# EAGLE design Standalone Control Board (EAGLE 7.1.0)
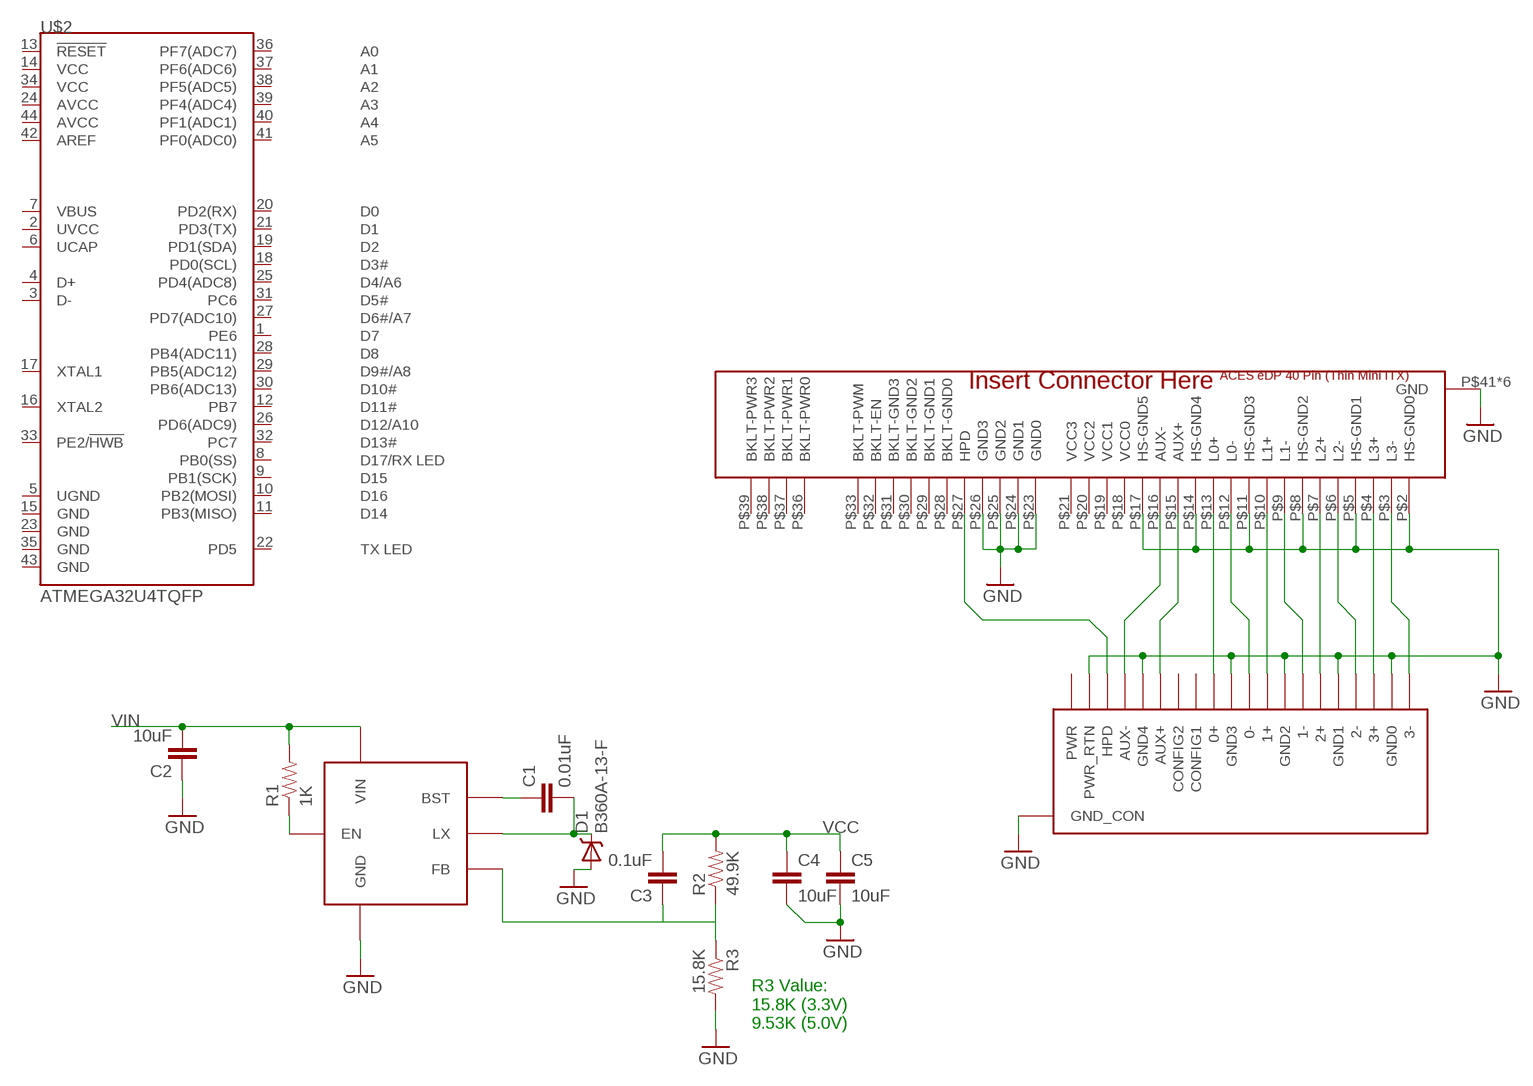
[diagram p0: schematic, sheet 1]

## Parts
C1  0.01uF  CAP0805  [0805]
C2  10uF  CAP0805  [0805]
C3  0.1uF  CAP0805  [0805]
C4  10uF  CAP0805  [0805]
C5  10uF  CAP0805  [0805]
D1  B360A-13-F  DIODE-SCHOTTKY_  [SMA-DIODE]
F1  EDP-40PIN-ACES  [ACES-50203-040]
R1  1K  RESISTOR0805-RES  [0805]
R2  49.9K  RESISTOR0805-RES  [0805]
R3  15.8K  RESISTOR0805-RES  [0805]
U$1  DP-SINK  [MOLEX-47272-0001]
U$2  ATMEGA32U4TQFP  [SPARKFUN-DIGITALIC_TQFP44]
U$3  AOZ1281-BUCK  [2X2-DFN]

## Nets
0_N: F1.P$12(L0-) U$1.P$14(0-)
0_P: F1.P$13(L0+) U$1.P$16(0+)
1_N: F1.P$9(L1-) U$1.P$11(1-)
1_P: F1.P$10(L1+) U$1.P$13(1+)
2_N: F1.P$6(L2-) U$1.P$8(2-)
2_P: F1.P$7(L2+) U$1.P$10(2+)
3_N: F1.P$3(L3-) U$1.P$5(3-)
3_P: F1.P$4(L3+) U$1.P$7(3+)
AUX_N: F1.P$16(AUX-) U$1.P$21(AUX-)
AUX_P: F1.P$15(AUX+) U$1.P$19(AUX+)
GND: C2.1 C4.2 C5.2 D1.A F1.P$2(HS-GND0) F1.P$5(HS-GND1) F1.P$8(HS-GND2) F1.P$11(HS-GND3) F1.P$14(HS-GND4) F1.P$17(HS-GND5) F1.P$23(GND0) F1.P$24(GND1) F1.P$25(GND2) F1.P$26(GND3) F1.P$41(GND) F1.P$42(GND) F1.P$43(GND) F1.P$44(GND) F1.P$45(GND) F1.P$46(GND) R3.2 U$1.GND1(GND_CON) U$1.GND2(GND_CON) U$1.GND3(GND_CON) U$1.GND4(GND_CON) U$1.P$6(GND0) U$1.P$9(GND1) U$1.P$12(GND2) U$1.P$15(GND3) U$1.P$20(GND4) U$1.P$23(PWR_RTN) U$3.6(GND) U$3.7(GND) U$3.CENTER(GND)
N$1: R1.1 U$3.4(EN)
N$2: C3.1 U$3.5(FB)
N$3: C1.1 U$3.8(BST)
N$4: C1.2 D1.C U$3.1(LX)
N$5: R2.1 R3.1
N$14: F1.P$27(HPD) U$1.P$22(HPD)
VCC: C3.2 C4.1 C5.1 R2.2
VIN: C2.2 R1.2 U$3.2(VIN) U$3.3(VIN)
Unconnected: F1.P$32(BKLT-EN) F1.P$33(BKLT-PWM) U$1.P$17(CONFIG1) U$1.P$18(CONFIG2) U$2.1(PE6) U$2.2(UVCC) U$2.3(D-) U$2.4(D+) U$2.5(UGND) U$2.6(UCAP) U$2.7(VBUS) U$2.8(PB0(SS)) U$2.9(PB1(SCK)) U$2.10(PB2(MOSI)) U$2.11(PB3(MISO)) U$2.12(PB7) U$2.13(!RESET) U$2.14(VCC) U$2.15(GND) U$2.16(XTAL2) U$2.17(XTAL1) U$2.18(PD0(SCL)) U$2.19(PD1(SDA)) U$2.20(PD2(RX)) U$2.21(PD3(TX)) U$2.22(PD5) U$2.23(GND) U$2.24(AVCC) U$2.25(PD4(ADC8)) U$2.26(PD6(ADC9)) U$2.27(PD7(ADC10)) U$2.28(PB4(ADC11)) U$2.29(PB5(ADC12)) U$2.30(PB6(ADC13)) U$2.31(PC6) U$2.32(PC7) U$2.33(PE2/!HWB) U$2.34(VCC) U$2.35(GND) U$2.36(PF7(ADC7)) U$2.37(PF6(ADC6)) U$2.38(PF5(ADC5)) U$2.39(PF4(ADC4)) U$2.40(PF1(ADC1)) U$2.41(PF0(ADC0)) U$2.42(AREF) U$2.43(GND) U$2.44(AVCC)

## Notes on the sheet
- R3 Value:
  15.8K (3.3V)
  9.53K (5.0V)

## Power pins joined to a net without a drawn wire
BKLT-GND0: F1.P$28(BKLT-GND0)
BKLT-GND1: F1.P$29(BKLT-GND1)
BKLT-GND2: F1.P$30(BKLT-GND2)
BKLT-GND3: F1.P$31(BKLT-GND3)
BKLT-PWR0: F1.P$36(BKLT-PWR0)
BKLT-PWR1: F1.P$37(BKLT-PWR1)
BKLT-PWR2: F1.P$38(BKLT-PWR2)
BKLT-PWR3: F1.P$39(BKLT-PWR3)
PWR: U$1.P$24(PWR)
VCC0: F1.P$18(VCC0)
VCC1: F1.P$19(VCC1)
VCC2: F1.P$20(VCC2)
VCC3: F1.P$21(VCC3)

## Library data of the parts
C1-C5 = SparkFun-Passives:CAP: Capacitor Standard 0603 ceramic capacitor, and 0.1" leaded capacitor.
D1 = SparkFun-DiscreteSemi:DIODE-SCHOTTKY: Commonly MBRA140.
F1 = LCD Connectors:EDP-40PIN-ACES
R1-R3 = SparkFun-Passives:RESISTOR: Resistor Basic schematic elements and footprints for 0603, 1206, and PTH resistors.
U$1 = LCD Connectors:DP-SINK
U$2 = SparkFun-DigitalIC:ATMEGA32U4: Atmel 44-pin 8-bit Microcontroller with 32KBytes of ISP Flash and USB Controller ----- Please use the QFN-44-NOPAD_1:1 package for the footprint of all boards using a 32U4. Route traces directly away from the pads as much as possible.
U$3 = LCD Connectors:AOZ1281-BUCK

## Board
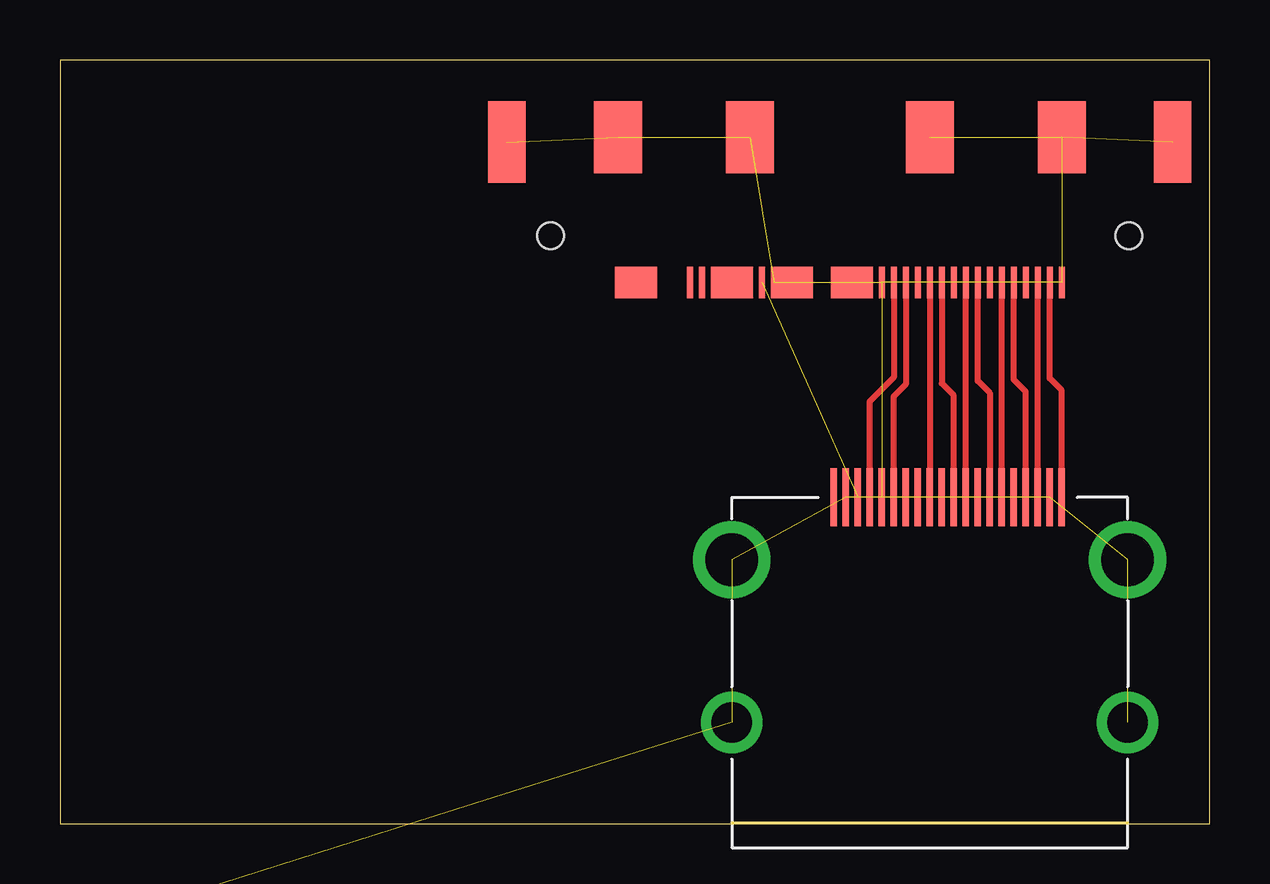
[diagram p1: board, top side]

Size 47.93 x 31.82 mm. Coordinates in mm from the lower left corner, seen from the top.
Outline: 0,0 47.93,0 47.93,31.82 0,31.82 0,0
Copper layers (1*16): Top 0.035mm / dielectric 1.5mm / Bottom 0.035mm
Design rules "default": minimum track width 10mil, minimum drill 24mil, track to track 8mil, track to pad 8mil, pad to pad 8mil, via to via 8mil, smd to smd 8mil, copper to edge 40mil, drill to drill 8mil, minimum pad ring 10mil, minimum via ring 8mil, stop-mask expansion 4mil, vias tented up to drill 0mil, thermal gap 10mil

### Footprints (pad centres in the part's own frame; a part is rotated, then mirrored left to right if it is on the bottom)
0805 = smd 0.8 x 1.2: 1 -0.9,0; 2 0.9,0
SMA-DIODE = smd 1.27 x 1.47: A -2.15,0; C 2.15,0
ACES-50203-040 = smd 0.25 x 1.3: P$2 -9.25,-0.65; P$3 -8.75,-0.65; P$4 -8.25,-0.65; P$5 -7.75,-0.65; P$6 -7.25,-0.65; P$7 -6.75,-0.65; P$8 -6.25,-0.65; P$9 -5.75,-0.65; P$10 -5.25,-0.65; P$11 -4.75,-0.65; P$12 -4.25,-0.65; P$13 -3.75,-0.65; P$14 -3.25,-0.65; P$15 -2.75,-0.65; P$16 -2.25,-0.65; P$17 -1.75,-0.65; P$18 -1.25,-0.65; P$21 0.25,-0.65; P$23 1.25,-0.65; P$26 2.75,-0.65; P$27 3.25,-0.65; P$28 3.75,-0.65; P$31 5.25,-0.65; P$32 5.75,-0.65; P$33 6.25,-0.65; P$36 7.75,-0.65; P$39 9.25,-0.65 | smd 1.25 x 1.3: P$19 -0.75,-0.65; P$20 -0.25,-0.65; P$24 1.75,-0.65; P$25 2.25,-0.65; P$29 4.25,-0.65; P$30 4.75,-0.65; P$37 8.25,-0.65; P$38 8.75,-0.65 | smd 1.55 x 3.4: P$41 -13.875,-6.5; P$42 13.875,-6.5 | smd 2 x 3: P$43 -9.25,-6.7; P$44 -3.75,-6.7; P$45 3.75,-6.7; P$46 9.25,-6.7 | hole 1.1: 12.05,-2.6; -12.05,-2.6
MOLEX-47272-0001 = drill 2.2 pad 2.8: GND1 0,0; GND3 16.5,0 | drill 1.7 pad 2.3: GND2 0,-6.78; GND4 16.5,-6.78 | smd 0.28 x 2.4: P$5 13.75,2.6; P$6 13.25,2.6; P$7 12.75,2.6; P$8 12.25,2.6; P$9 11.75,2.6; P$10 11.25,2.6; P$11 10.75,2.6; P$12 10.25,2.6; P$13 9.75,2.6; P$14 9.25,2.6; P$15 8.75,2.6; P$16 8.25,2.6; P$17 7.75,2.6; P$18 7.25,2.6; P$19 6.75,2.6; P$20 6.25,2.6; P$21 5.75,2.6; P$22 5.25,2.6; P$23 4.75,2.6; P$24 4.25,2.6
SPARKFUN-DIGITALIC_TQFP44 = smd 1.5 x 0.5: 1 -5.8,4; 2 -5.8,3.2; 3 -5.8,2.4; 4 -5.8,1.6; 5 -5.8,0.8; 6 -5.8,0; 7 -5.8,-0.8; 8 -5.8,-1.6; 9 -5.8,-2.4; 10 -5.8,-3.2; 11 -5.8,-4; 23 5.8,-4; 24 5.8,-3.2; 25 5.8,-2.4; 26 5.8,-1.6; 27 5.8,-0.8; 28 5.8,0; 29 5.8,0.8; 30 5.8,1.6; 31 5.8,2.4; 32 5.8,3.2; 33 5.8,4 | smd 0.5 x 1.5: 12 -4,-5.8; 13 -3.2,-5.8; 14 -2.4,-5.8; 15 -1.6,-5.8; 16 -0.8,-5.8; 17 0,-5.8; 18 0.8,-5.8; 19 1.6,-5.8; 20 2.4,-5.8; 21 3.2,-5.8; 22 4,-5.8; 34 4,5.8; 35 3.2,5.8; 36 2.4,5.8; 37 1.6,5.8; 38 0.8,5.8; 39 0,5.8; 40 -0.8,5.8; 41 -1.6,5.8; 42 -2.4,5.8; 43 -3.2,5.8; 44 -4,5.8
2X2-DFN = smd 0.25 x 0.3: 1 1.5,0; 2 1,0; 3 0.5,0; 4 0,0; 5 0,-1.7; 6 0.5,-1.7; 7 1,-1.7; 8 1.5,-1.7 | smd 1.5 x 0.9: CENTER 0.75,-0.85

### Placement (x,y rotation side)
C1  -36.35,-12.45 0 top  (outside the outline)
C2  -39.2,-12.45 0 top  (outside the outline)
C3  -47.85,-12.45 0 top  (outside the outline)
C4  -50.8,-12.45 0 top  (outside the outline)
C5  -53.65,-12.45 0 top  (outside the outline)
D1  -52.25,-27.6 0 top  (outside the outline)
F1  32.5,21.9 180 top
R1  -33.5,-12.45 0 top  (outside the outline)
R2  -42.15,-12.45 0 top  (outside the outline)
R3  -45,-12.45 0 top  (outside the outline)
U$1  28,11 0 top
U$2  -22.5,-7.75 0 top  (outside the outline)
U$3  -31.05,-12.4 0 top  (outside the outline)

### Tracks (layer width: path | path; a pad name or v marks a point on that pad's centre or on a via)
0_N
  Top 0.254: U$1.P$14 37.25,17.85 36.75,18.35 F1.P$12
0_P
  Top 0.254: F1.P$13 U$1.P$16
1_N
  Top 0.254: U$1.P$11 38.75,17.95 38.25,18.45 F1.P$9
1_P
  Top 0.254: U$1.P$13 F1.P$10
2_N
  Top 0.254: U$1.P$8 40.25,18 39.75,18.5 F1.P$6
2_P
  Top 0.254: U$1.P$10 F1.P$7
3_N
  Top 0.254: U$1.P$5 41.75,18.05 41.25,18.55 F1.P$3
3_P
  Top 0.254: U$1.P$7 F1.P$4
AUX_N
  Top 0.254: U$1.P$21 33.75,17.6 34.75,18.6 F1.P$16
AUX_P
  Top 0.254: U$1.P$19 34.75,17.8 35.25,18.3 F1.P$15
GND  (33 unrouted)
N$1  (1 unrouted)
N$2  (1 unrouted)
N$3  (1 unrouted)
N$4  (2 unrouted)
N$5  (1 unrouted)
N$14  (1 unrouted)
VCC  (3 unrouted)
VIN  (3 unrouted)